# EAGLE schematic ChargingSchematicFH (EAGLE 7.7.0)
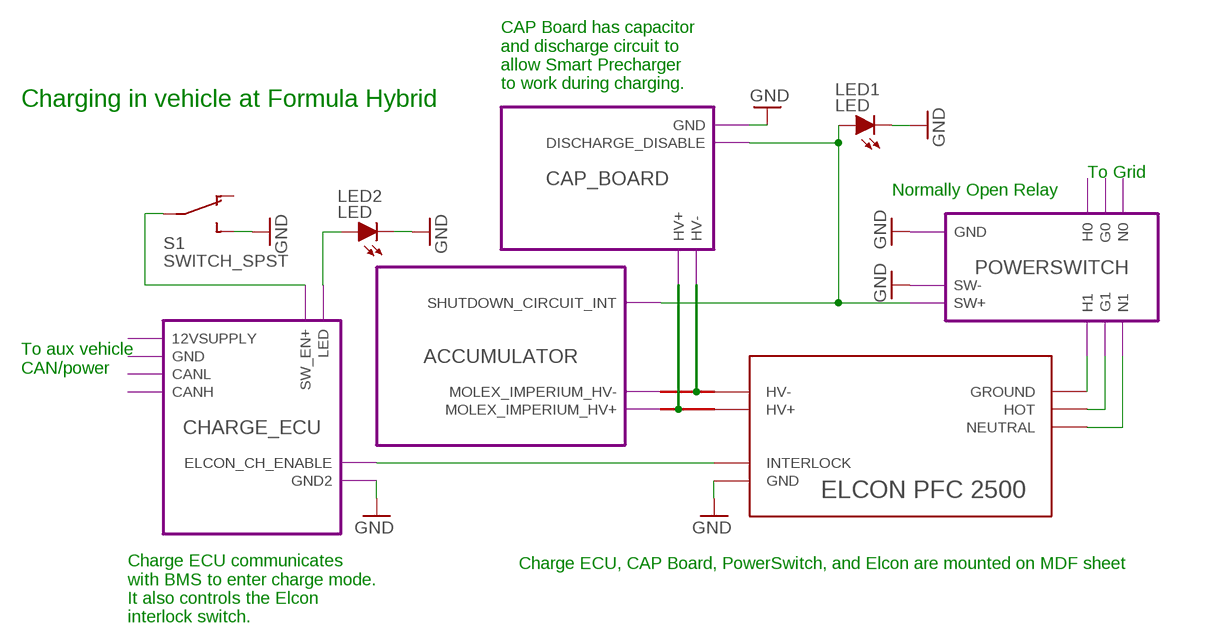
[diagram p0: schematic, sheet 1]

## Parts
LED1  LED  (no package)
LED2  LED  (no package)
S1  SWITCH_SPST  (no package)
U$1  ELCON_PFC_2500  (no package)

## Module instances
ACCUMULATOR = ACCUMULATOR
POWERSWITCH = POWERSWITCH
CHARGE_ECU = CHARGE_ECU
CAP_BOARD = CAP_BOARD

## Nets
GND: LED1.C LED2.C S1.S U$1.GND ; port POWERSWITCH.GND POWERSWITCH.SW- CHARGE_ECU.GND2 CAP_BOARD.GND
N$1: U$1.INTERLOCK ; port CHARGE_ECU.ELCON_CH_ENABLE
N$2: U$1.GROUND ; port POWERSWITCH.H1
N$3: port CAP_BOARD.HV+
N$4: port CAP_BOARD.HV-
N$5: U$1.HOT ; port POWERSWITCH.G1
N$6: U$1.NEUTRAL ; port POWERSWITCH.N1
N$7: LED1.A ; port ACCUMULATOR.SHUTDOWN_CIRCUIT_INT POWERSWITCH.SW+ CAP_BOARD.DISCHARGE_DISABLE
N$8: S1.P ; port CHARGE_ECU.SW_EN+
N$9: LED2.A ; port CHARGE_ECU.LED
Unconnected: S1.O U$1.HV+ U$1.HV-

## Notes on the sheet
- CAP Board has capacitor
  and discharge circuit to
  allow Smart Precharger
  to work during charging.
- Charging in vehicle at Formula Hybrid
- To Grid
- Normally Open Relay
- To aux vehicle
  CAN/power
- Charge ECU, CAP Board, PowerSwitch, and Elcon are mounted on MDF sheet
- Charge ECU communicates
  with BMS to enter charge mode.
  It also controls the Elcon
  interlock switch.

## Library data of the parts
LED1 LED2 = HyTechSymbols:LED: Generic LED
S1 = HyTechSymbols:SWITCH_SPST: Single Pull Single Throw Switch
U$1 = HyTechSymbols:ELCON_PFC_2500

## Module ACCUMULATOR
Ports: MOLEX_IMPERIUM_HV-(in) MOLEX_IMPERIUM_HV+(out) SHUTDOWN_CIRCUIT_INT(out)

### Library data of the parts

## Module POWERSWITCH
Ports: G1(nc) H1(nc) N1(nc) G0(nc) H0(nc) N0(nc) GND(out) SW-(out) SW+(in)

### Library data of the parts

## Module CHARGE_ECU
Ports: CANL(io) CANH(io) 12VSUPPLY(in) GND(out) SW_EN+(out) GND2(in) ELCON_CH_ENABLE(out) LED(out)

### Library data of the parts

## Module CAP_BOARD
Ports: HV+(in) HV-(out) DISCHARGE_DISABLE(in) GND(out)

### Library data of the parts